# EAGLE schematic nrf51_hid_joy (EAGLE 7.1.0)
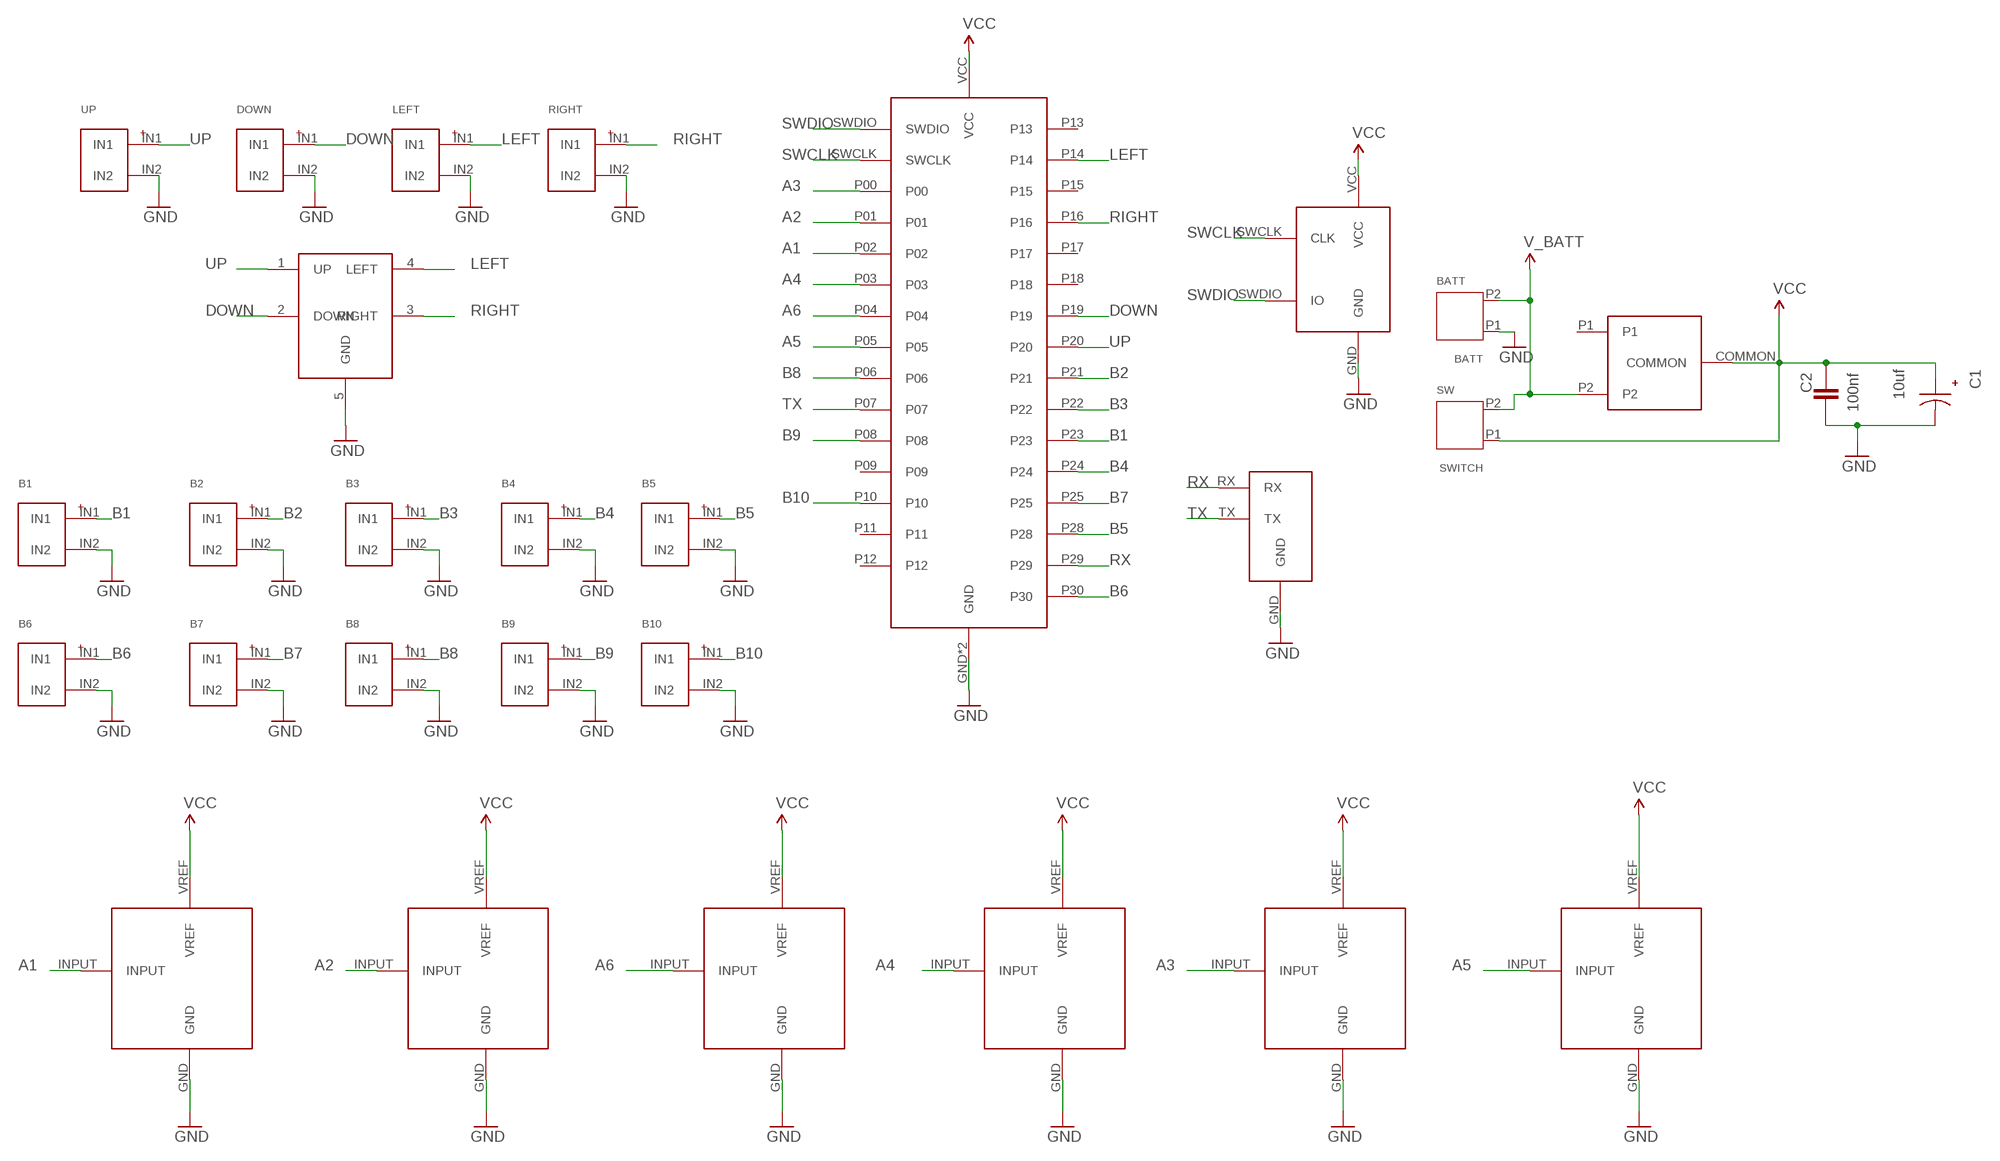
[diagram p0: schematic, sheet 1]

## Parts
A1  A1  ANALOG_INPUT2.54  [ANALOG_INPUT]
A2  A2  ANALOG_INPUT2.54  [ANALOG_INPUT]
A3  A3  ANALOG_INPUT2.54  [ANALOG_INPUT]
A4  A4  ANALOG_INPUT2.54  [ANALOG_INPUT]
A5  A5  ANALOG_INPUT2.54  [ANALOG_INPUT]
A6  A6  ANALOG_INPUT2.54  [ANALOG_INPUT]
B1  B1  JST254  [JST254]
B2  B2  JST254  [JST254]
B3  B3  JST254  [JST254]
B4  B4  JST254  [JST254]
B5  B5  JST254  [JST254]
B6  B6  JST254  [JST254]
B7  B7  JST254  [JST254]
B8  B8  JST254  [JST254]
B9  B9  JST254  [JST254]
B10  B10  JST254  [JST254]
BATT  BATT  SCREW-TERM-2P3.5  [2P-3.5]
C1  10uf  CAP_POLPTH1  [CAPA-RAD-MEDIUM]
C2  100nf  CAP0805  [0805]
DOWN  DOWN  JST254  [JST254]
LEFT  LEFT  JST254  [JST254]
RIGHT  RIGHT  JST254  [JST254]
SWITCH  SW  SCREW-TERM-2P3.5  [2P-3.5]
U$1  NRF51_MODULEBIG  [NRF51-MODULE]
U$2  NRF51_PROG  [PROG_SWD]
U$3  NRF51_SERIAL  [NRF51_SERIAL]
U$14  5_5PINS_JOY  [5_PINS_CONNECTOR]
U$23  SWITCH  [SS-12D00G3]
UP  UP  JST254  [JST254]

## Nets
A1: A1.INPUT U$1.P02
A2: A2.INPUT U$1.P01
A3: A3.INPUT U$1.P00
A4: A4.INPUT U$1.P03
A5: A5.INPUT U$1.P05
A6: A6.INPUT U$1.P04
B1: B1.IN1 U$1.P23
B2: B2.IN1 U$1.P21
B3: B3.IN1 U$1.P22
B4: B4.IN1 U$1.P24
B5: B5.IN1 U$1.P28
B6: B6.IN1 U$1.P30
B7: B7.IN1 U$1.P25
B8: B8.IN1 U$1.P06
B9: B9.IN1 U$1.P08
B10: B10.IN1 U$1.P10
DOWN: DOWN.IN1 U$1.P19 U$14.2(DOWN)
GND: A1.GND A2.GND A3.GND A4.GND A5.GND A6.GND B1.IN2 B2.IN2 B3.IN2 B4.IN2 B5.IN2 B6.IN2 B7.IN2 B8.IN2 B9.IN2 B10.IN2 BATT.P1 C1.2(-) C2.1 DOWN.IN2 LEFT.IN2 RIGHT.IN2 U$1.GND U$1.GND2(GND) U$2.GND U$3.GND U$14.5(GND) UP.IN2
LEFT: LEFT.IN1 U$1.P14 U$14.4(LEFT)
RIGHT: RIGHT.IN1 U$1.P16 U$14.3(RIGHT)
RX: U$1.P29 U$3.RX
SWCLK: U$1.SWCLK U$2.SWCLK(CLK)
SWDIO: U$1.SWDIO U$2.SWDIO(IO)
TX: U$1.P07 U$3.TX
UP: U$1.P20 U$14.1(UP) UP.IN1
V_BATT: BATT.P2 SWITCH.P2 U$23.P2
VCC: A1.VREF A2.VREF A3.VREF A4.VREF A5.VREF A6.VREF C1.1(+) C2.2 SWITCH.P1 U$1.VCC U$2.VCC U$23.COMMON
Unconnected: U$1.P09 U$1.P11 U$1.P12 U$1.P13 U$1.P15 U$1.P17 U$1.P18 U$23.P1

## Library data of the parts
A1-A6 = nrf51_hid_joy:ANALOG_INPUT
B1-B10 DOWN LEFT RIGHT UP = nrf51_hid_joy:JST254
BATT SWITCH = nrf51_hid_joy:SCREW-TERM-2P
C1 = nrf51_hid_joy:CAP_POL: Capacitor Polarized These are standard SMD and PTH capacitors. Normally 10uF, 47uF, and 100uF in electrolytic and tantalum varieties. Always verify the external diameter of the through hole cap, it varies with capacity, voltage, and manufacturer. The EIA devices should be standard.
C2 = nrf51_hid_joy:CAP: Capacitor Standard 0603 ceramic capacitor, and 0.1" leaded capacitor.
U$1 = nrf51_hid_joy:NRF51_MODULE
U$2 = nrf51_hid_joy:NRF51_PROG
U$3 = nrf51_hid_joy:NRF51_SERIAL
U$14 = nrf51_hid_joy:5_5PINS_JOY
U$23 = nrf51_hid_joy:SWITCH